# Altium schematic sheet NearField_H_Probe.SchDoc
size A4
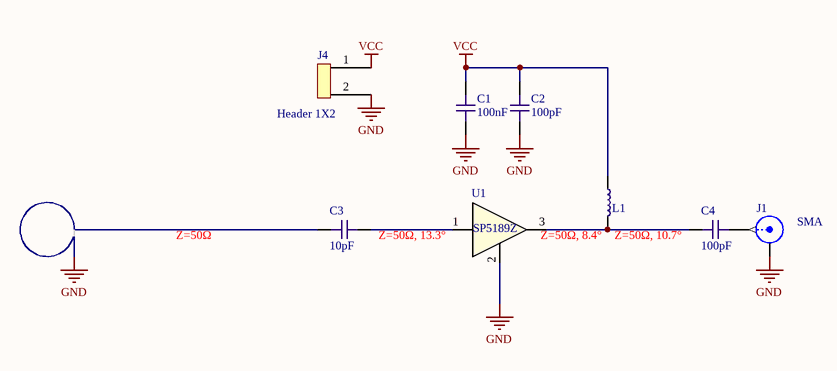
[diagram p0: NearField_H_Probe.SchDoc]

## Parts
C1  value 100nF  [C0402-IPC]  (hidden comment: C0402 100nF 10V X5R)
C2  value 100pF  [C0402-IPC]  (hidden comment: C0402 100pF 50V C0G)
C3  value 10pF  [C0402-IPC]  (hidden comment: C0402 10pF 50V C0G)
C4  value 100pF  [C0402-IPC]  (hidden comment: C0402 100pF 50V C0G)
J1  SMA  [SMA Edge Launch (Horizontal)]
J4  Header 1X2  [Header 1x2 TH Pitch 2.54mm]
L1  LQW15AN47NG8ZD  [L0402-Murata-WW-High-Density]  (value not drawn)
U1  SP5189Z  [SOT-89]

## Nets
GND: C1.1 C2.1 C3.1 J1.2(Y) J4.2 U1.2(GND)
VCC: C1.2 C2.2 J4.1 L1.1
NetC3_2: C3.2 U1.1(RFIN)
NetC4_1: C4.1 L1.2 U1.3(RFOUT/DCBIAS)
NetC4_2: C4.2 J1.1(X)

## Notes on the sheet
- Z=50Ω
- Z=50Ω, 13.3°
- Z=50Ω, 8.4°
- Z=50Ω, 10.7°

## Library data of the parts
C1 = C0402 100nF 10V X5R: Chip Capacitor, 0402, 100nF, 10V, X5R; EIA Code: X5R; Max. Voltage: 10V; Supplier 1: Digi-Key; Supplier Part Number 1: 311-1336-1-ND
C2 C4 = C0402 100pF 50V C0G: Chip Capacitor, 0402, 100p, 1%, 50V, C0G; Max. Voltage: 50V; EIA Code: C0G; Supplier 1: Digi-Key; Supplier Part Number 1: 490-7753-1-ND
C3 = C0402 10pF 50V C0G: Chip Capacitor, 0402, 10pF, 50V, C0G; Max. Voltage: 50V; EIA Code: C0G; Supplier 1: Digi-Key; Supplier Part Number 1: 490-8077-1-ND
J1 = SMA: SMA Connector; Supplier 1: Digi-Key; Supplier Part Number 1: A97594-ND
L1 = L0402 47nH High-Q: 47nH Unshielded Wirewound Inductor 440mA 648mOhm Max 0402 (1005 Metric); Supplier 1: Digi-Key; Supplier 2: Mouser; Supplier Part Number 1: 490-15449-1-ND; Supplier Part Number 2: 81-LQW15AN47NG8ZD; Value: 47nH
U1 = SPF5189Z: RF Amplifier .05-4GHz SSG 12.8dB NF .8dB GaAs; Supplier 2: Mouser; Supplier Part Number 2: 772-SPF5189Z